# EAGLE design motor control board (EAGLE 5.06)
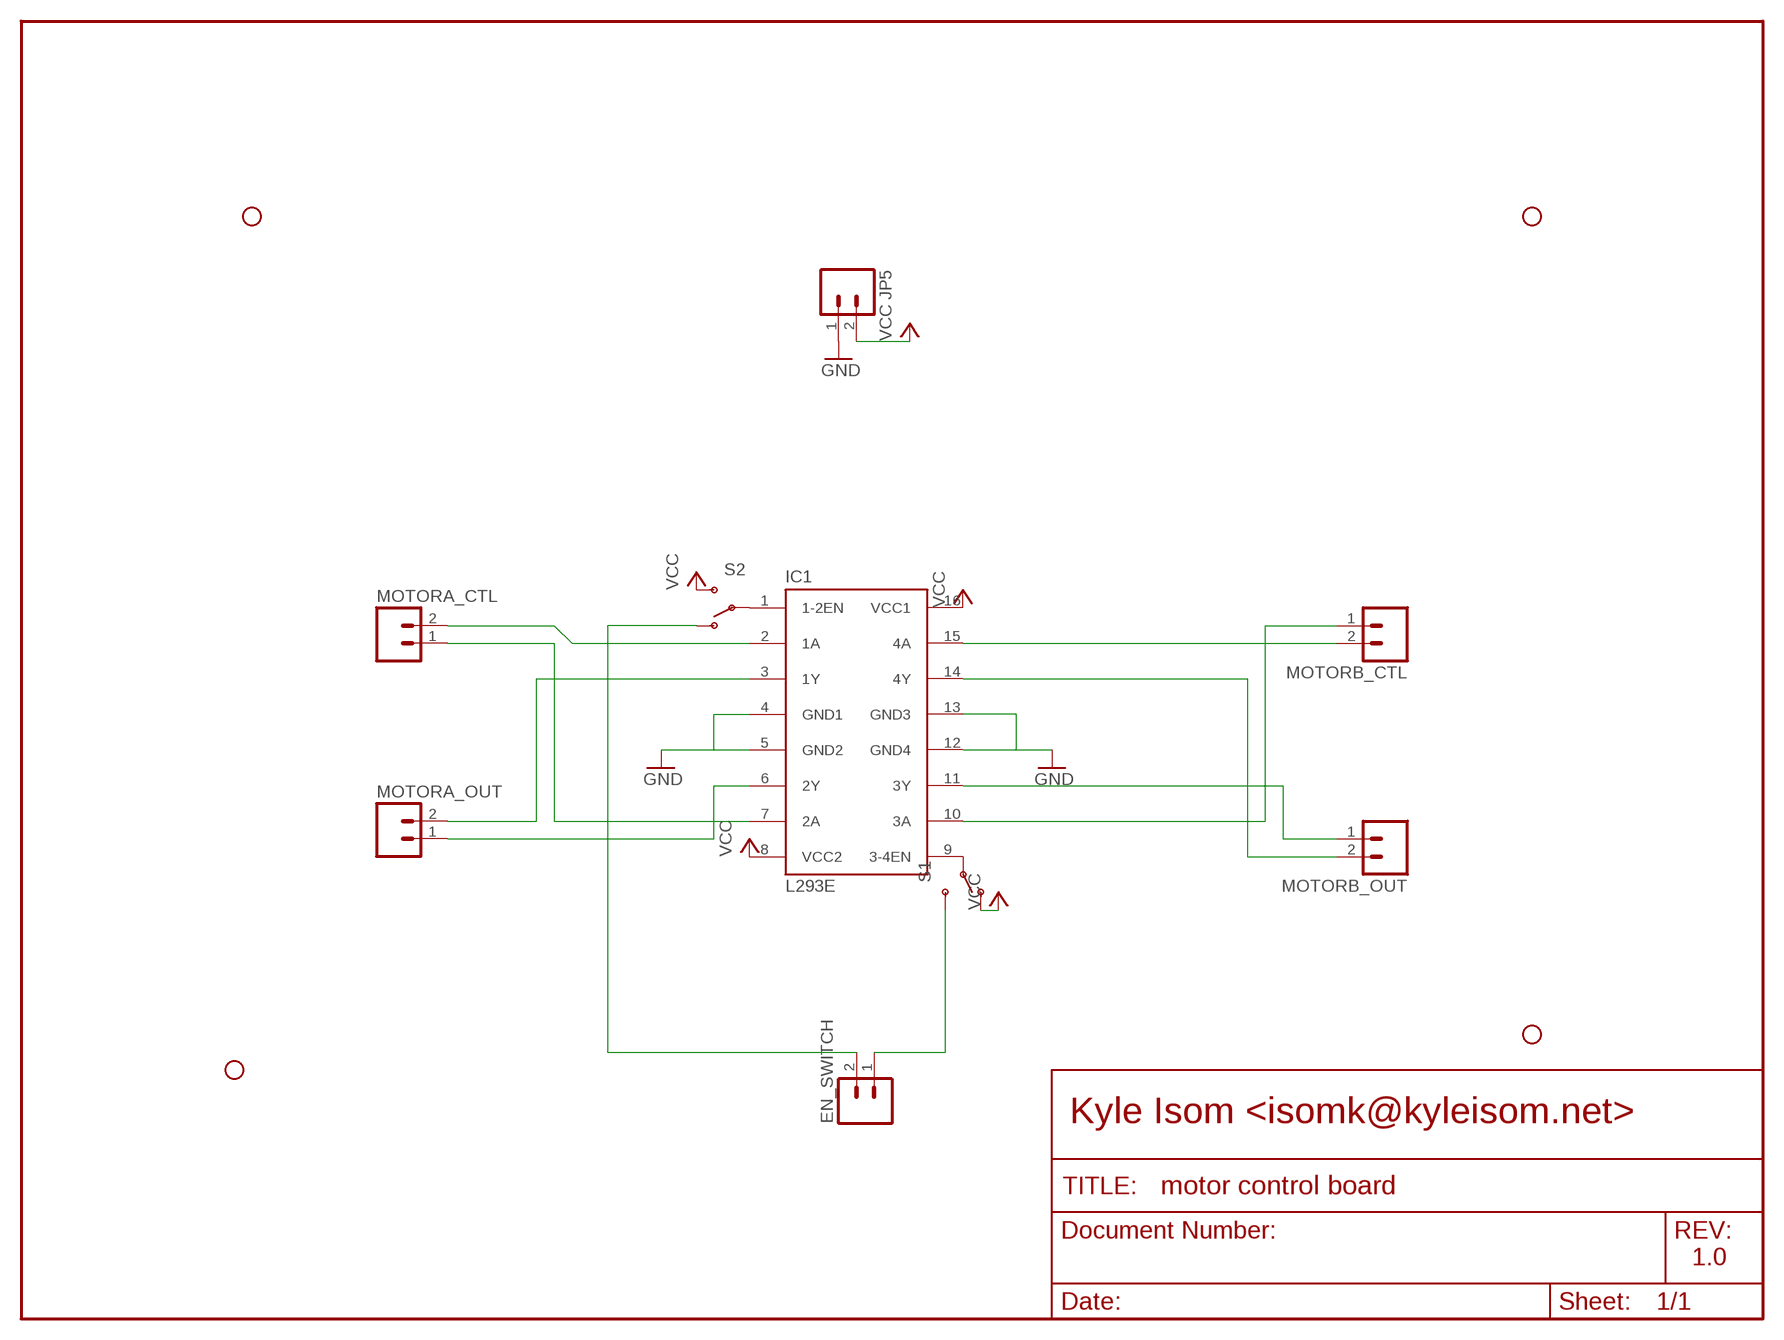
[diagram p0: schematic, sheet 1]

## Parts
EN_SWITCH  M02LOCK  [1X02_LOCK]
IC1  L293E  [DIL16]
JP1  STAND-OFFTIGHT  [STAND-OFF-TIGHT]
JP2  STAND-OFFTIGHT  [STAND-OFF-TIGHT]
JP3  STAND-OFFTIGHT  [STAND-OFF-TIGHT]
JP4  STAND-OFFTIGHT  [STAND-OFF-TIGHT]
JP5  M02-JST-2MM-SMT  [S2B-PH]
MOTORA_CTL  M02LOCK  [1X02_LOCK]
MOTORA_OUT  M02LOCK  [1X02_LOCK]
MOTORB_CTL  M02LOCK  [1X02_LOCK]
MOTORB_OUT  M02LOCK  [1X02_LOCK]
S1  SWITCH-SPSTPTH_LOCK  [SWITCH-SPDT_LOCK.007S]
S2  SWITCH-SPSTPTH_LOCK  [SWITCH-SPDT_LOCK.007S]

## Nets
GND: IC1.4(GND1) IC1.5(GND2) IC1.12(GND4) IC1.13(GND3) JP5.1
N$1: IC1.2(1A) MOTORA_CTL.2
N$2: IC1.3(1Y) MOTORA_OUT.2
N$3: IC1.7(2A) MOTORA_CTL.1
N$4: IC1.6(2Y) MOTORA_OUT.1
N$5: IC1.10(3A) MOTORB_CTL.1
N$6: IC1.15(4A) MOTORB_CTL.2
N$7: IC1.14(4Y) MOTORB_OUT.2
N$8: IC1.11(3Y) MOTORB_OUT.1
N$9: IC1.1(1-2EN) S2.2(P)
N$10: IC1.9(3-4EN) S1.2(P)
N$11: EN_SWITCH.1 S1.3(S)
N$12: EN_SWITCH.2 S2.1(O)
VCC: IC1.8(VCC2) IC1.16(VCC1) JP5.2 S1.1(O) S2.3(S)

## Notes on the sheet
- Kyle Isom <isomk@kyleisom.net>
- 1.0

## Library data of the parts
EN_SWITCH JP5 MOTORA_CTL MOTORA_OUT MOTORB_CTL MOTORB_OUT = SparkFun:M02: Header 2 Standard 2-pin 0.1" header. Use with straight break away headers (SKU : PRT-00116), right angle break away headers (PRT-00553), swiss pins (PRT-00743), machine pins (PRT-00117), and female headers (PRT-00115). Molex polarized connector foot print use with SKU : PRT-08233 with associated crimp pins and housings.
IC1 = texas:L293E: TI DEVICE
JP1-JP4 = SparkFun:STAND-OFF: Stand Off This is the mechanical footprint for a #4 phillips button head screw. Use the keepout ring to avoid running the screw head into surrounding components. SKU : PRT-00447
S1 S2 = SparkFun:SWITCH-SPST: SPST Switch Simple slide switch. Spark Fun Electronics SKU : COM-00102

## Board
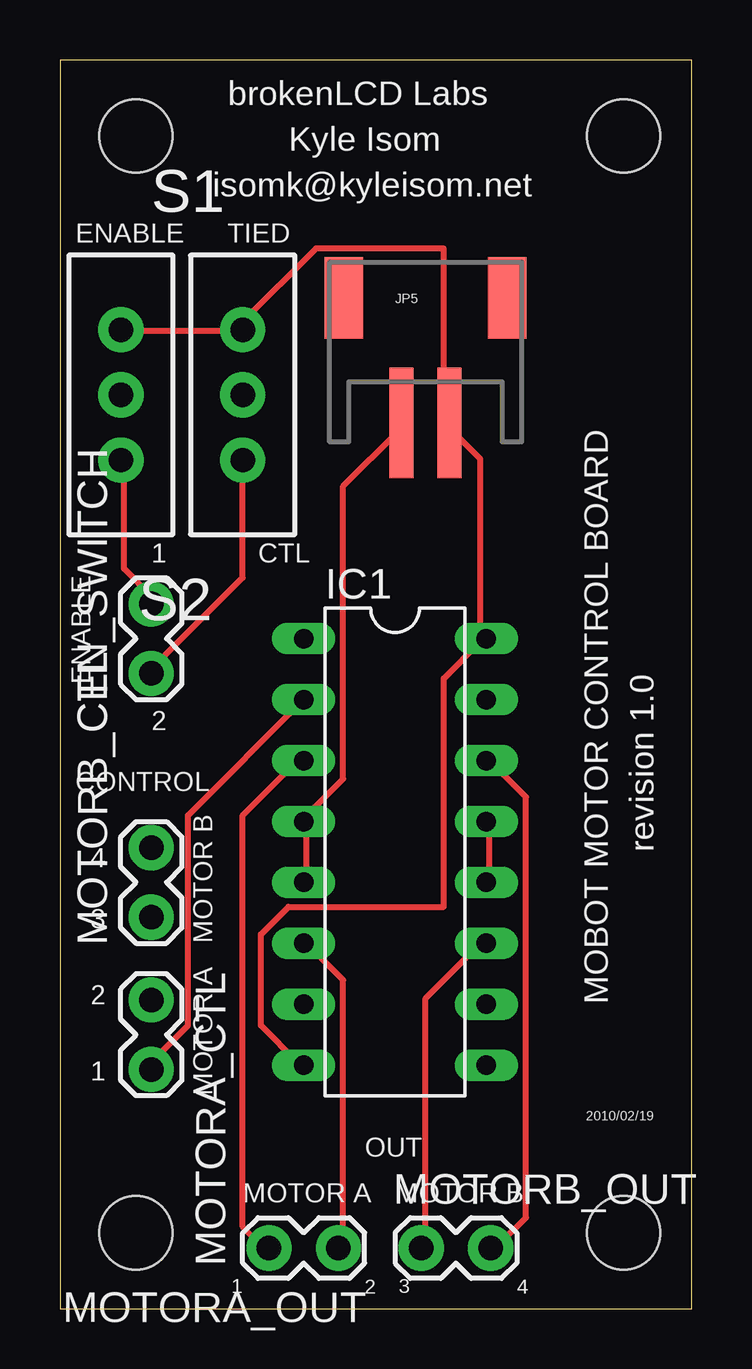
[diagram p1: board, top side]
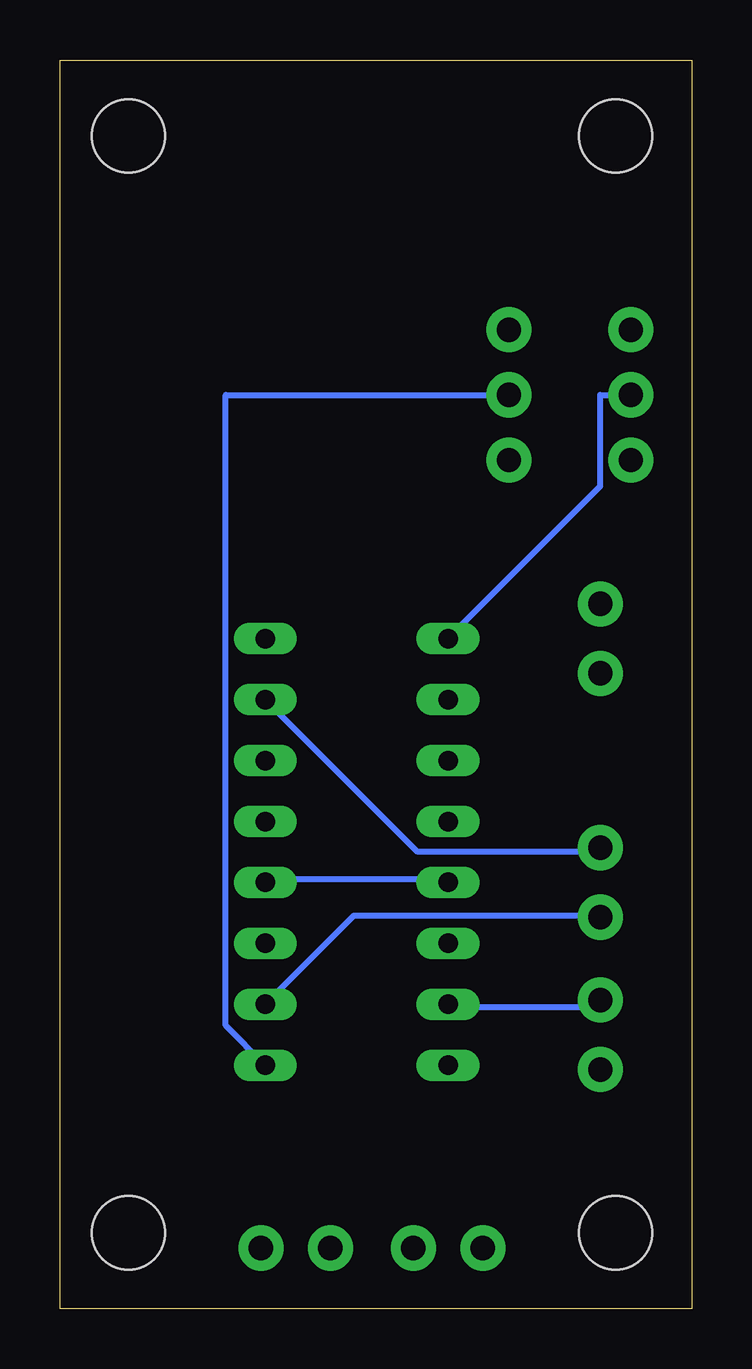
[diagram p2: board, bottom side, seen from below]

Size 26.34 x 52.06 mm. Coordinates in mm from the lower left corner, seen from the top.
Outline: 0,0 26.34,0 26.34,52.06 0,52.06 0,0
Copper layers (1*16): Top 0.035mm / dielectric 1.5mm / Bottom 0.035mm
Design rules "default": minimum track width 10mil, minimum drill 24mil, track to track 8mil, track to pad 8mil, pad to pad 8mil, via to via 8mil, smd to smd 8mil, copper to edge 40mil, drill to drill 8mil, minimum pad ring 10mil, minimum via ring 8mil, stop-mask expansion 4mil, vias tented up to drill 0mil, thermal gap 10mil

### Footprints (pad centres in the part's own frame; a part is rotated, then mirrored left to right if it is on the bottom)
1X02_LOCK = drill 1.016 pad 1.88 round: 1 -0.178,0; 2 2.718,0
DIL16 = drill 0.813 long: 1 -8.89,-3.81; 2 -6.35,-3.81; 3 -3.81,-3.81; 4 -1.27,-3.81; 5 1.27,-3.81; 6 3.81,-3.81; 7 6.35,-3.81; 8 8.89,-3.81; 9 8.89,3.81; 10 6.35,3.81; 11 3.81,3.81; 12 1.27,3.81; 13 -1.27,3.81; 14 -3.81,3.81; 15 -6.35,3.81; 16 -8.89,3.81
STAND-OFF-TIGHT = hole 3.048: 0,0
S2B-PH = smd 1 x 4.6: 1 -1,-3.7; 2 1,-3.7 | smd 1.6 x 3.4: NC1 -3.4,1.5; NC2 3.4,1.5
SWITCH-SPDT_LOCK.007S = drill 1.016 pad 1.88 round: 1 0,2.718; 2 0,0; 3 0,-2.718

### Placement (x,y rotation side)
EN_SWITCH  3.81,26.67 90 top
IC1  13.97,19.05 270 top
JP1  23.5,48.9 0 top
JP2  23.5,3.17 0 top
JP3  3.17,3.17 0 top
JP4  3.17,48.9 0 top
JP5  15.24,40.64 0 top
MOTORA_CTL  3.81,12.7 270 top
MOTORA_OUT  11.43,2.54 180 top
MOTORB_CTL  3.81,16.51 90 top
MOTORB_OUT  15.24,2.54 0 top
S1  7.62,38.1 0 top
S2  2.54,38.1 180 top

### Tracks (layer width: path | path; a pad name or v marks a point on that pad's centre or on a via)
GND
  Top 0.254: IC1.5 10.29,17.91 10.29,20.19 IC1.4 10.29,20.57 11.81,22.1 11.81,34.29 14.1,36.58 JP5.1 | IC1.12 17.91,17.91 17.91,20.19 IC1.13
  Bottom 0.254: IC1.5 10.29,17.91 17.53,17.91 IC1.12
N$1
  Top 0.254: IC1.2 5.33,20.57 5.33,11.81 3.81,10.29 MOTORA_CTL.2
N$2
  Top 0.254: IC1.3 9.91,22.86 7.62,20.57 7.62,3.43 8.38,2.67 MOTORA_OUT.2
N$3
  Bottom 0.254: IC1.7 9.91,12.57 3.81,12.57 MOTORA_CTL.1
N$4
  Top 0.254: IC1.6 10.29,15.24 11.81,13.72 11.81,2.67 MOTORA_OUT.1
N$5
  Bottom 0.254: IC1.10 14.1,16.38 3.81,16.38 MOTORB_CTL.1
N$6
  Bottom 0.254: IC1.15 11.43,19.05 3.81,19.05 MOTORB_CTL.2
N$7
  Top 0.254: IC1.14 17.91,22.86 19.43,21.34 19.43,3.81 18.29,2.67 MOTORB_OUT.2
N$8
  Top 0.254: IC1.11 17.53,15.24 15.24,12.95 15.24,2.67 MOTORB_OUT.1
N$9
  Bottom 0.254: IC1.1 3.81,34.29 3.81,38.1 S2.2
N$10
  Bottom 0.254: S1.2 19.43,38.1 19.43,11.81 IC1.9
N$11
  Top 0.254: EN_SWITCH.1 3.81,26.67 7.62,30.48 S1.3
N$12
  Top 0.254: EN_SWITCH.2 3.81,29.72 2.67,30.86 2.67,35.05 S2.1
VCC
  Top 0.254: S2.3 2.67,40.77 7.62,40.77 S1.1 7.62,41.15 10.67,44.2 16,44.2 16,36.96 JP5.2 16.38,36.58 17.53,35.43 17.53,28.19 IC1.16 17.53,27.81 16,26.29 16,16.76 9.53,16.76 8.38,15.62 8.38,11.81 9.91,10.29 IC1.8

### Text on the board
tPlace: brokenLCD Labs | Kyle Isom | isomk@kyleisom.net | ENABLE | TIED | 1 | CTL | ENABLE | 2 | CONTROL | revision 1.0 | 4 | 3 | MOTOR B | 2 | MOBOT MOTOR CONTROL BOARD | 1 | MOTOR A | 2010/02/19 | OUT | MOTOR A | MOTOR B | 1 | 2 | 3 | 4